# Altium schematic sheet 24.SchDoc
size 513 x 386 mm
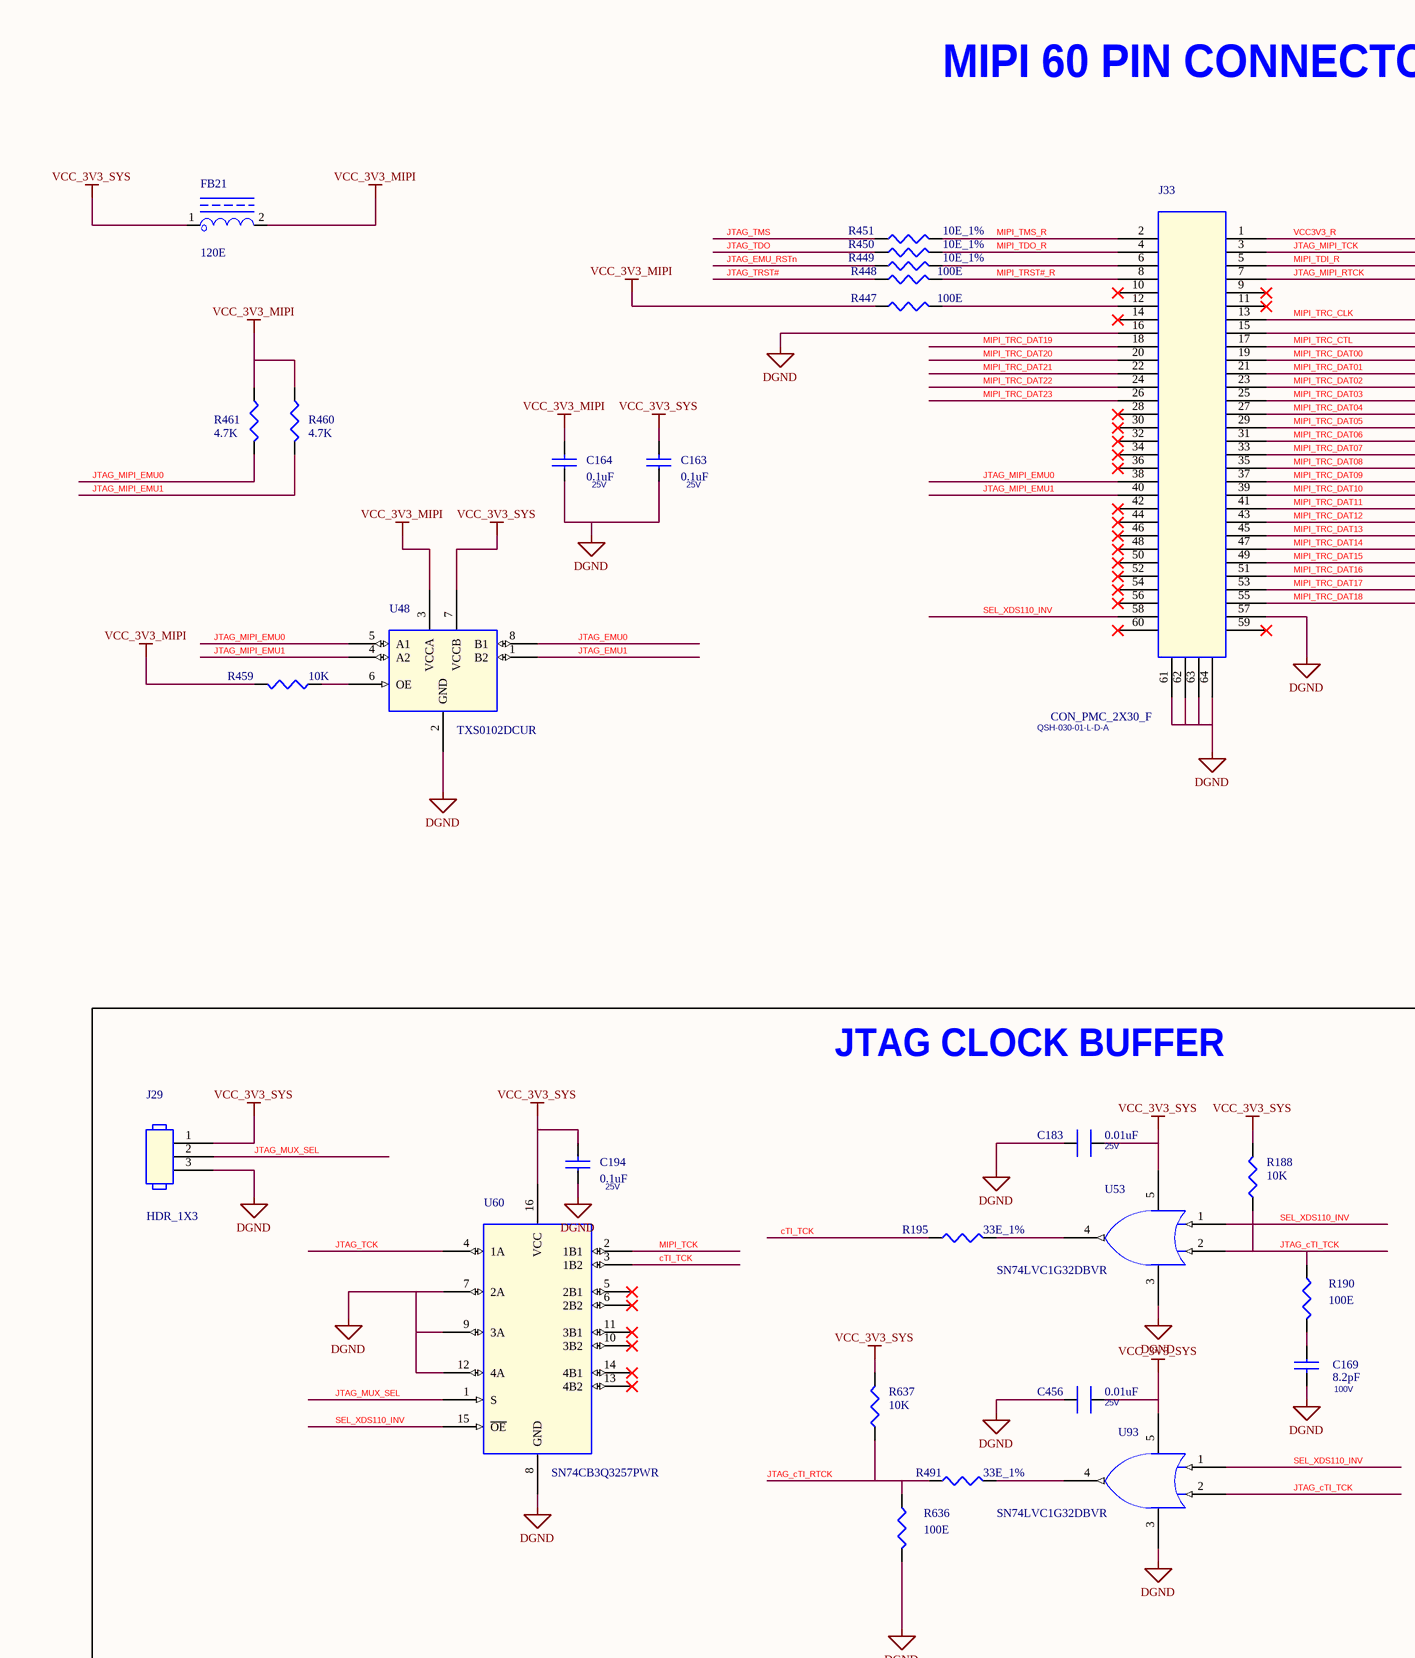
[diagram p0: 24.SchDoc, top left]
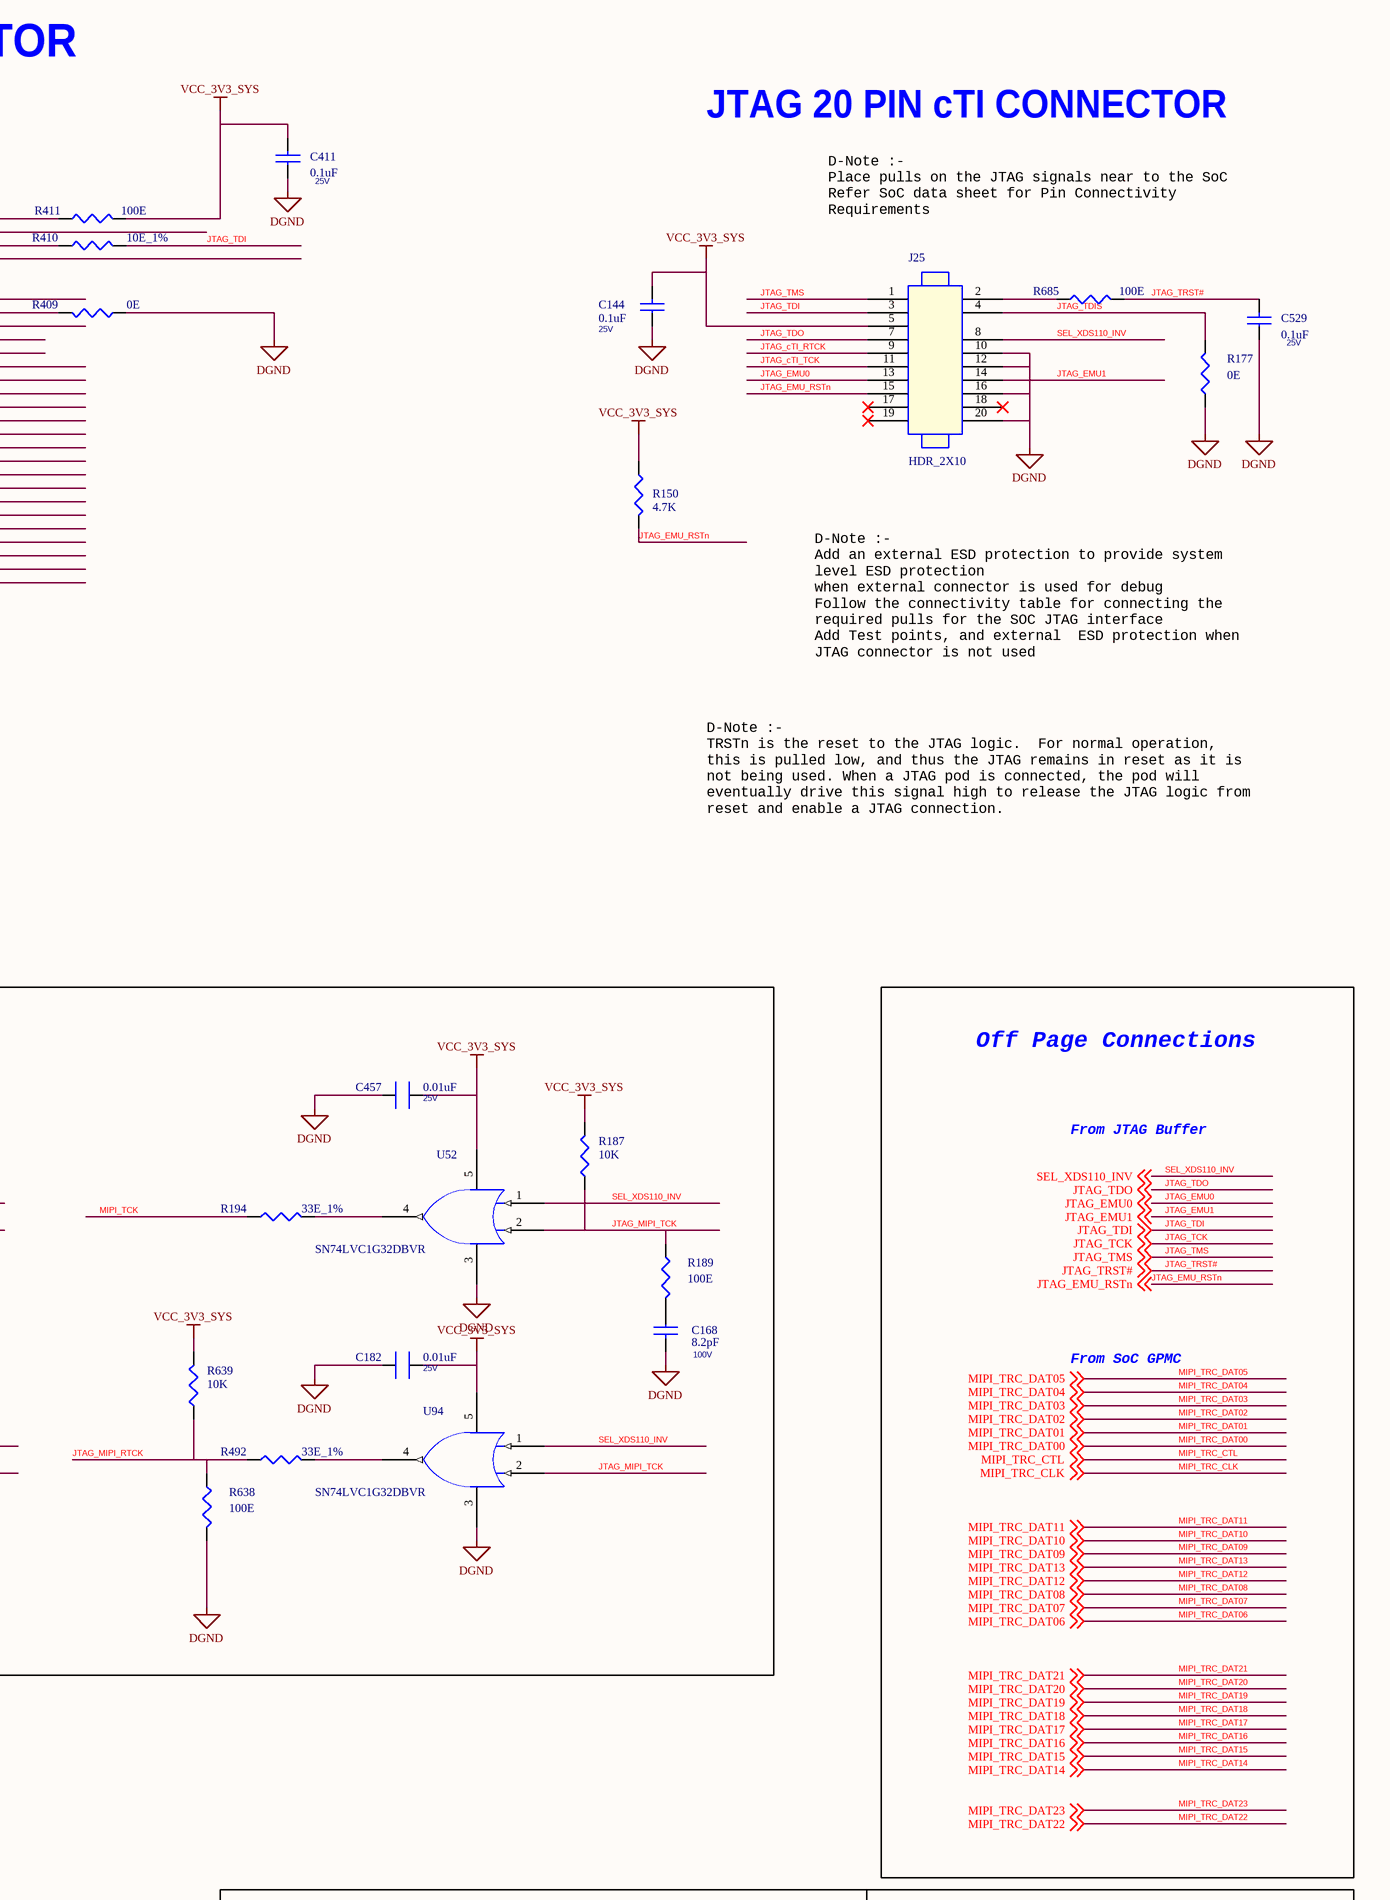
[diagram p1: 24.SchDoc, top right]
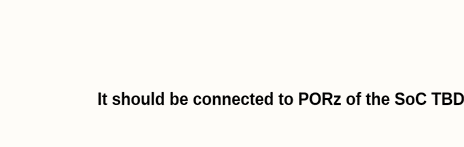
[diagram p2: 24.SchDoc, bottom left]
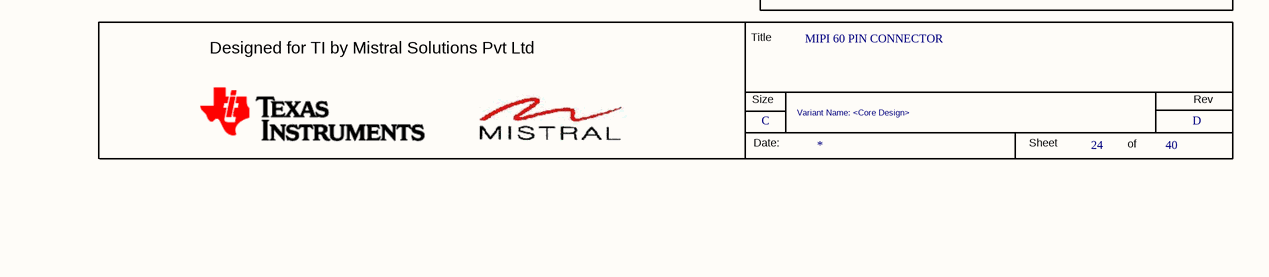
[diagram p3: 24.SchDoc, bottom right]

## Parts
*  RevCode: D  Title: MIPI 60 PIN CONNECTOR  Page Size: C  Page Number: 24  Page Count: 40  Variant Name: <Core Design>  (hidden comment: MISTRAL_TITLEBLK_CSIZE)  (graphical)
C144  0.1uF  Voltage: 25V  [CAP0402_0-75]
C163  0.1uF  Voltage: 25V  [CAP0402_0-75]
C164  0.1uF  Voltage: 25V  [CAP0402_0-75]
C168  8.2pF  Voltage: 100V  [CAP0402_0-75]
C169  8.2pF  Voltage: 100V  [CAP0402_0-75]
C182  0.01uF  Voltage: 25V  [CAP0402N]
C183  0.01uF  Voltage: 25V  [CAP0402N]
C194  0.1uF  Voltage: 25V  [CAP0402_0-75]
C411  0.1uF  Voltage: 25V  [CAP0402_0-75]
C456  0.01uF  Voltage: 25V  [CAP0402N]
C457  0.01uF  Voltage: 25V  [CAP0402N]
C529  0.1uF  Voltage: 25V  [CAP0402_0-75]
FB21  120E  [IND0603_1]
J25  HDR_2X10  [HDR_2X10_FTR-110-51-D-06_S_S_8-7]
J29  HDR_1X3  [HDR_3X1_100_S_T]
J33  CON_PMC_2X30_F  Mfr_part_number: QSH-030-01-L-D-A  [CON_PMC2X30_QSH-030-01-D-A_S_S_S_3-3]
R150  4.7K  [RES0402_0-5]
R177  0E  [RES0402_0-5]
R187  10K  [RES0402_0-5]
R188  10K  [RES0402_0-5]
R189  100E  [RES0402_0-5]
R190  100E  [RES0402_0-5]
R194  33E_1%  [RES0402_0-5]
R195  33E_1%  [RES0402_0-5]
R409  0E  [RES0402N]
R410  10E_1%  [RES0402N]
R411  100E  [RES0402N]
R447  100E  [RES0402N]
R448  100E  [RES0402N]
R449  10E_1%  [RES0402N]
R450  10E_1%  [RES0402N]
R451  10E_1%  [RES0402N]
R459  10K  [RES0402_0-5]
R460  4.7K  [RES0402_0-5]
R461  4.7K  [RES0402_0-5]
R491  33E_1%  [RES0402_0-5]
R492  33E_1%  [RES0402_0-5]
R636  100E  [RES0402_0-5]
R637  10K  [RES0402_0-5]
R638  100E  [RES0402_0-5]
R639  10K  [RES0402_0-5]
R685  100E  [RES0402N]
U48  TXS0102DCUR  [VSSOP8_19-68_85X95_0-9]
U52  SN74LVC1G32DBVR  [SOT23-5_1-5]
U53  SN74LVC1G32DBVR  [SOT23-5_1-5]
U60  SN74CB3Q3257PWR  [TSSOP16_25-59_205X180]
U93  SN74LVC1G32DBVR  [SOT23-5_1-5]
U94  SN74LVC1G32DBVR  [SOT23-5_1-5]

## Blocks framed on the sheet
JTAG CLOCK BUFFER: C168 C169 C182 C183 C194 C456 C457 J29 R187-R190 R194 R195 R491 R492 R636-R639 U52 U53 U60 U93 U94

## Nets
DGND: C144.1 C163.1 C164.1 C168.2 C169.2 C182.1 C183.1 C194.1 C411.1 C456.1 C457.1 C529.1 J25.10 J25.12 J25.16 J25.20 J29.3 J33.16 J33.57 J33.61 J33.62 J33.63 J33.64 R177.1 R409.1 R636.2 R638.2 U48.2(GND) U52.3(GND) U53.3(GND) U60.7(2A) U60.8(GND) U60.9(3A) U60.12(4A) U93.3(GND) U94.3(GND)
VCC_3V3_MIPI: C164.2 FB21.2 R447.1 R459.2 R460.1 R461.1 U48.3(VCCA)
VCC_3V3_SYS: C144.2 C163.2 C182.2 C183.2 C194.2 C411.2 C456.2 C457.2 FB21.1 J25.5 J29.1 R150.1 R187.2 R188.2 R411.2 R637.2 R639.2 U48.7(VCCB) U52.5(VCC) U53.5(VCC) U60.16(VCC) U93.5(VCC) U94.5(VCC)
cTI_TCK: R195.1 U60.3(1B2)
JTAG_cTI_RTCK: J25.9 R491.1 R636.1 R637.1
JTAG_cTI_TCK: J25.11 R188.1 R190.1 U53.2(B) U93.2(B)
JTAG_EMU0: J25.13 U48.8(B1) ; off-sheet JTAG_EMU0
JTAG_EMU1: J25.14 U48.1(B2) ; off-sheet JTAG_EMU1
JTAG_EMU_RSTn: J25.15 R150.2 R449.1 ; off-sheet JTAG_EMU_RSTn
JTAG_MIPI_EMU0: J33.38 R461.2 U48.5(A1)
JTAG_MIPI_EMU1: J33.40 R460.2 U48.4(A2)
JTAG_MIPI_RTCK: J33.7 R492.1 R638.1 R639.1
JTAG_MIPI_TCK: J33.3 R187.1 R189.1 U52.2(B) U94.2(B)
JTAG_MUX_SEL: J29.2 U60.1(S)
JTAG_TCK: U60.4(1A) ; off-sheet JTAG_TCK
JTAG_TDI: J25.3 R410.2 ; off-sheet JTAG_TDI
JTAG_TDIS: J25.4 R177.2
JTAG_TDO: J25.7 R450.1 ; off-sheet JTAG_TDO
JTAG_TMS: J25.1 R451.1 ; off-sheet JTAG_TMS
JTAG_TRST#: C529.2 R448.1 R685.2 ; off-sheet JTAG_TRST#
MIPI_TCK: R194.1 U60.2(1B1)
MIPI_TDI_R: J33.5 R410.1
MIPI_TDO_R: J33.4 R450.2
MIPI_TMS_R: J33.2 R451.2
MIPI_TRC_CLK: J33.13 ; off-sheet MIPI_TRC_CLK
MIPI_TRC_CTL: J33.17 ; off-sheet MIPI_TRC_CTL
MIPI_TRC_DAT00: J33.19 ; off-sheet MIPI_TRC_DAT00
MIPI_TRC_DAT01: J33.21 ; off-sheet MIPI_TRC_DAT01
MIPI_TRC_DAT02: J33.23 ; off-sheet MIPI_TRC_DAT02
MIPI_TRC_DAT03: J33.25 ; off-sheet MIPI_TRC_DAT03
MIPI_TRC_DAT04: J33.27 ; off-sheet MIPI_TRC_DAT04
MIPI_TRC_DAT05: J33.29 ; off-sheet MIPI_TRC_DAT05
MIPI_TRC_DAT06: J33.31 ; off-sheet MIPI_TRC_DAT06
MIPI_TRC_DAT07: J33.33 ; off-sheet MIPI_TRC_DAT07
MIPI_TRC_DAT08: J33.35 ; off-sheet MIPI_TRC_DAT08
MIPI_TRC_DAT09: J33.37 ; off-sheet MIPI_TRC_DAT09
MIPI_TRC_DAT10: J33.39 ; off-sheet MIPI_TRC_DAT10
MIPI_TRC_DAT11: J33.41 ; off-sheet MIPI_TRC_DAT11
MIPI_TRC_DAT12: J33.43 ; off-sheet MIPI_TRC_DAT12
MIPI_TRC_DAT13: J33.45 ; off-sheet MIPI_TRC_DAT13
MIPI_TRC_DAT14: J33.47 ; off-sheet MIPI_TRC_DAT14
MIPI_TRC_DAT15: J33.49 ; off-sheet MIPI_TRC_DAT15
MIPI_TRC_DAT16: J33.51 ; off-sheet MIPI_TRC_DAT16
MIPI_TRC_DAT17: J33.53 ; off-sheet MIPI_TRC_DAT17
MIPI_TRC_DAT18: J33.55 ; off-sheet MIPI_TRC_DAT18
MIPI_TRC_DAT19: J33.18 ; off-sheet MIPI_TRC_DAT19
MIPI_TRC_DAT20: J33.20 ; off-sheet MIPI_TRC_DAT20
MIPI_TRC_DAT21: J33.22 ; off-sheet MIPI_TRC_DAT21
MIPI_TRC_DAT22: J33.24 ; off-sheet MIPI_TRC_DAT22
MIPI_TRC_DAT23: J33.26 ; off-sheet MIPI_TRC_DAT23
MIPI_TRST#_R: J33.8 R448.2
SEL_XDS110_INV: J25.8 J33.58 U52.1(A) U53.1(A) U60.15(~{OE}) U93.1(A) U94.1(A) ; off-sheet SEL_XDS110_INV
VCC3V3_R: J33.1 R411.1
NetC168_1: C168.1 R189.2
NetC169_1: C169.1 R190.2
NetJ25_2: J25.2 R685.1
NetJ33_6: J33.6 R449.2
NetJ33_12: J33.12 R447.2
NetJ33_15: J33.15 R409.2
NetR194_2: R194.2 U52.4(Y)
NetR195_2: R195.2 U53.4(Y)
NetR459_1: R459.1 U48.6(OE)
NetR491_2: R491.2 U93.4(Y)
NetR492_2: R492.2 U94.4(Y)

Not connected (* = marked no-connect by the designer): J25 17* 18* 19*; J33 9* 10* 11* 14* 28* 30* 32* 34* 36* 42* 44* 46* 48* 50* 52* 54* 56* 59* 60*; U60 5(2B1)* 6(2B2)* 10(3B2)* 11(3B1)* 13(4B2)* 14(4B1)*

## Notes on the sheet
- MIPI 60 PIN CONNECTOR
- JTAG 20 PIN cTI CONNECTOR
- D-Note :-
  Place pulls on the JTAG signals near to the SoC
  Refer SoC data sheet for Pin Connectivity
  Requirements
- D-Note :-
  Add an external ESD protection to provide system
  level ESD protection
  when external connector is used for debug
  Follow the connectivity table for connecting the
  required pulls for the SOC JTAG interface
  Add Test points, and external  ESD protection when
  JTAG connector is not used
- D-Note :-
  TRSTn is the reset to the JTAG logic.  For normal operation,
  this is pulled low, and thus the JTAG remains in reset as it is
  not being used. When a JTAG pod is connected, the pod will
  eventually drive this signal high to release the JTAG logic from
  reset and enable a JTAG connection.
- Off Page Connections
- From JTAG Buffer
- From SoC GPMC
- It should be connected to PORz of the SoC TBD
- (in symbol MISTRAL_TITLEBLK_CSIZE) Title; Designed for TI by Mistral Solutions Pvt Ltd; Size; Rev; Date:; Sheet; of

## Library data of the parts
* = MISTRAL_TITLEBLK_CSIZE: Issue: 1.0; Page Create Date: March  8, 1995; Page Modify Date: *
C144 C163 C164 C194 C411 = CAP_Dup3: CAP CERAMIC 0.1uF 25V 20% X5R 0402; Alt_Mfr_name: YAGEO AMERICA; Part_type: CAPACITORS\CERAMIC; Mfr_part_number: 885012105018; Mfr_name: WURTH ELECTRONICS; Mistral Part No: 120020080003-R; Alt_Mfr_part_number: CC0402KRX5R8BB104; Custom_Duty: 15%; Customs_HS_Code: 85322990; Wattage: NA; Project: AM64x_EVM_BRD; Footprint Path: Y:\MIS_DATABASE\Library\ALTIUM_TOOL\PCB_FOOTPRINTS\Altium_Footprint_Lib.PcbLib; Library Path: Y:\MIS_DATABASE\Library\ALTIUM_TOOL\SCHEMATICS_PARTS\MS_DISCRETE_Library.schlib; Footprint Ref: CAP0402_0-75; Library Ref: CAP; MECHANICAL 3D STEP FILE: CAP0402_0-75; Chkd/date: MANIRAJA/170820; Crtd /date: ALVY/170820; Datasheet: Y:\MIS_DATABASE\DATASHEETS\CAPACITORS\885012105018.PDF; Temperature: -55癈+85癈; Weight: 0.65mg; Height: 0.55MM; Distributor_part_number: 732-7495-1-ND; Distributor_name: DIGIKEY; Package: 0402; Tolerance: 20%; PCB Footprint: CAP0402_0-75
C168 = CAP_Dup3: CAP CERAMIC 8.2pF 100V 0.5pF C0G(NP0) 0402; Part_type: CAPACITORS\CERAMIC; Mfr_part_number: 885012005085; Mfr_name: WURTH ELECTRONICS; Mistral Part No: 120020080006-R; Wattage: NA; Custom_Duty: 15%; Customs_HS_Code: 85322990; Tolerance: 0.5pF%; Project: AM64x_EVM_BRD; PCB Footprint: CAP0402_0-75; Footprint Path: Y:\MIS_DATABASE\Library\ALTIUM_TOOL\PCB_FOOTPRINTS\Altium_Footprint_Lib.PcbLib; Library Path: Y:\MIS_DATABASE\Library\ALTIUM_TOOL\SCHEMATICS_PARTS\MS_DISCRETE_Library.schlib; Footprint Ref: CAP0402_0-75; Library Ref: CAP; MECHANICAL 3D STEP FILE: CAP0402_0-75; Chkd/date: MANIRAJA/170820; Crtd /date: ALVY/170820; Datasheet: Y:\MIS_DATABASE\DATASHEETS\CAPACITORS\885012005085.PDF; Temperature: -55癈+125癈; Weight: 2.261mg; Height: 0.55MM; Distributor_part_number: 732-12053-1-ND; Distributor_name: DIGIKEY; Package: 0402
C169 = CAP_Dup3: CAP CERAMIC 8.2pF 100V 0.5pF C0G(NP0) 0402; Mistral Part No: 120020080006-R; Mfr_name: WURTH ELECTRONICS; Mfr_part_number: 885012005085; Part_type: CAPACITORS\CERAMIC; Project: AM64x_EVM_BRD; Tolerance: 0.5pF%; Customs_HS_Code: 85322990; Custom_Duty: 15%; Wattage: NA; PCB Footprint: CAP0402_0-75; Package: 0402; Distributor_name: DIGIKEY; Distributor_part_number: 732-12053-1-ND; Height: 0.55MM; Weight: 2.261mg; Temperature: -55癈+125癈; Datasheet: Y:\MIS_DATABASE\DATASHEETS\CAPACITORS\885012005085.PDF; Crtd /date: ALVY/170820; Chkd/date: MANIRAJA/170820; MECHANICAL 3D STEP FILE: CAP0402_0-75; Library Ref: CAP; Footprint Ref: CAP0402_0-75; Library Path: Y:\MIS_DATABASE\Library\ALTIUM_TOOL\SCHEMATICS_PARTS\MS_DISCRETE_Library.schlib; Footprint Path: Y:\MIS_DATABASE\Library\ALTIUM_TOOL\PCB_FOOTPRINTS\Altium_Footprint_Lib.PcbLib
C182 C183 C457 = CAP_Dup2: CAP CERAMIC 0.01uF 25V 10% X7R 0402; Part_type: CAPACITORS\CERAMIC; Mfr_part_number: 885012205050; Mfr_name: WURTH ELECTRONICS; Mistral Part No: 120011090040-R; PCB Footprint: CAP0402_0-75; Wattage: NA; Custom_Duty: 15%; Customs_HS_Code: 85322990; Project: AM64x_EVM_BRD; Footprint Path: Y:\MIS_DATABASE\Library\ALTIUM_TOOL\PCB_FOOTPRINTS\Altium_Footprint_Lib.PcbLib; Library Path: Y:\MIS_DATABASE\Library\ALTIUM_TOOL\SCHEMATICS_PARTS\MS_DISCRETE_Library.schlib; Footprint Ref: CAP0402_0-75; MECHANICAL 3D STEP FILE: CAP0402_0-75; Temperature: -55癈+125癈; Weight: 0.65mg; Chkd/date: MANIRAJA/170820; Crtd /date: ALVY/170820; Datasheet: Y:\MIS_DATABASE\DATASHEETS\CAPACITORS\885012205050.PDF; Height: 0.55MM; Distributor_part_number: 732-7545-1-ND; Distributor_name: DIGIKEY; Package: 0402; Tolerance: 10%; Library Ref: CAP
C456 = CAP_Dup2: CAP CERAMIC 0.01uF 25V 10% X7R 0402; Mistral Part No: 120011090040-R; Mfr_name: WURTH ELECTRONICS; Mfr_part_number: 885012205050; Part_type: CAPACITORS\CERAMIC; PCB Footprint: CAP0402_0-75; Project: AM64x_EVM_BRD; Customs_HS_Code: 85322990; Custom_Duty: 15%; Wattage: NA; Library Ref: CAP; Tolerance: 10%; Package: 0402; Distributor_name: DIGIKEY; Distributor_part_number: 732-7545-1-ND; Height: 0.55MM; Datasheet: Y:\MIS_DATABASE\DATASHEETS\CAPACITORS\885012205050.PDF; Crtd /date: ALVY/170820; Chkd/date: MANIRAJA/170820; Weight: 0.65mg; Temperature: -55癈+125癈; MECHANICAL 3D STEP FILE: CAP0402_0-75; Footprint Ref: CAP0402_0-75; Library Path: Y:\MIS_DATABASE\Library\ALTIUM_TOOL\SCHEMATICS_PARTS\MS_DISCRETE_Library.schlib; Footprint Path: Y:\MIS_DATABASE\Library\ALTIUM_TOOL\PCB_FOOTPRINTS\Altium_Footprint_Lib.PcbLib
C529 = CAP_Dup3: CAP CERAMIC 0.1uF 25V 20% X5R 0402; Alt_Mfr_part_number: CC0402KRX5R8BB104; Mistral Part No: 120020080003-R; Mfr_name: WURTH ELECTRONICS; Mfr_part_number: 885012105018; Part_type: CAPACITORS\CERAMIC; Alt_Mfr_name: YAGEO AMERICA; Project: AM64x_EVM_BRD; Wattage: NA; Customs_HS_Code: 85322990; Custom_Duty: 15%; Tolerance: 20%; Package: 0402; Distributor_name: DIGIKEY; Distributor_part_number: 732-7495-1-ND; Height: 0.55MM; Weight: 0.65mg; Temperature: -55癈+85癈; Datasheet: Y:\MIS_DATABASE\DATASHEETS\CAPACITORS\885012105018.PDF; Crtd /date: ALVY/170820; Chkd/date: MANIRAJA/170820; MECHANICAL 3D STEP FILE: CAP0402_0-75; Library Ref: CAP; Footprint Ref: CAP0402_0-75; Library Path: Y:\MIS_DATABASE\Library\ALTIUM_TOOL\SCHEMATICS_PARTS\MS_DISCRETE_Library.schlib; Footprint Path: Y:\MIS_DATABASE\Library\ALTIUM_TOOL\PCB_FOOTPRINTS\Altium_Footprint_Lib.PcbLib; PCB Footprint: CAP0402_0-75
FB21 = INDUCTOR_FERRITE: IND FERRITE BEAD CHIP 120E 2A 0603; Mfr_part_number: 782631141; Mfr_name: WURTH ELECTRONICS; Mistral Part No: 130020080015-R; Custom_Duty: 24%; Customs_HS_Code: 85437099; Wattage: NA; Tolerance: 25%; Project: AM64x_EVM_BRD; Footprint Path: Y:\MIS_DATABASE\Library\ALTIUM_TOOL\PCB_FOOTPRINTS\Altium_Footprint_Lib.PcbLib; Library Path: Y:\MIS_DATABASE\Library\ALTIUM_TOOL\SCHEMATICS_PARTS\MS_FILTER_Library.schlib; MECHANICAL 3D STEP FILE: IND0603_1; Chkd/date: MANIRAJA/180820; Crtd /date: ALVY/180820; Datasheet: Y:\MIS_DATABASE\DATASHEETS\DISCRETES\INDUCTORS\782631141.PDF; Temperature: -55癈+125癈; Weight: NA; Height: 1.00MM; Library Ref: INDUCTOR_FERRITE; Distributor_part_number: 732-782631141CT-ND; Distributor_name: DIGIKEY; Package: 0603; Voltage: NA; Part_type: INDUCTOR; Footprint Ref: IND0603_1; PCB Footprint: IND0603_1
J25 = HEADER_10X2_FTR-06: CON HDR 2X10 1.27MM PITCH ST SMD; Mistral Part No: 150011090001-R; Mfr_name: SAMTEC; Mfr_part_number: FTR-110-51-S-D-06; Part_type: CONNECTOR\HEADERS; Project: GEMYC; Tolerance: NA; Customs_HS_Code: 85369090; Custom_Duty: 24%; Footprint Ref: HDR_2X10_FTR-110-51-D-06_S_S_8-7; Voltage: NA; Wattage: NA; Package: SMD; Distributor_name: DIGIKEY; Distributor_part_number: SAM8792-ND; Library Ref: HEADER_10X2_FTR-06; Height: 8.67MM; Weight: NA; Temperature: -55癈+125癈; Datasheet: Y:\MIS_DATABASE\DATASHEETS\CONNECTORS\FTR-D-SER.PDF; Crtd /date: CHAITHANYA/050811; Chkd/date: MANIRAJA/031218; MECHANICAL 3D STEP FILE: HDR_2X10_FTR-110-51-D-06_S_S_8-7; Library Path: Y:\MIS_DATABASE\Library\ALTIUM_TOOL\SCHEMATICS_PARTS\MS_CONNECTOR_Library.schlib; Footprint Path: Y:\MIS_DATABASE\Library\ALTIUM_TOOL\PCB_FOOTPRINTS\Altium_Footprint_Lib.PcbLib; PCB Footprint: HDR_2X10_FTR-110-51-D-06_S_S_8-7
J29 = HEADER_3X1: HDR 1X3 2.54MM PITCH ST TH; Part_type: CONNECTOR\HEADERS; Mfr_part_number: 68001-403HLF; Mfr_name: FCI; Mistral Part No: 150016060025-R; Custom_Duty: 15%; Customs_HS_Code: 85322990; Wattage: NA; Project: IKEYP; Library Ref: HEADER_3X1; Chkd/date: VASANTHA/290616; Crtd /date: VASANTHA/290616; Datasheet: Y:\MIS_DATABASE\DATASHEETS\CONNECTORS\68000.PDF; Temperature: -40癈+105癈; Weight: NA; Height: 8.58MM; Distributor_part_number: 609-3471-ND; Distributor_name: DIGIKEY; Package: THRU-HOLE; Voltage: NA; Tolerance: NA; PCB Footprint: HDR_3X1_100_S_T
J33 = CON_PMC_30X2_F: CON PMC 2X30 0.50MM PITCH FEMALE ST SMD; Part_type: CONNECTOR\PMC; Mfr_name: SAMTEC; Mistral Part No: 150009030606-R; Wattage: NA; Custom_Duty: 24%; Customs_HS_Code: 85369090; Project: KHAN_HSST; PCB Footprint: CON_PMC2X30_QSH-030-01-D-A_S_S_S_3-3; Footprint Path: Y:\MIS_DATABASE\Library\ALTIUM_TOOL\PCB_FOOTPRINTS\Altium_Footprint_Lib.PcbLib; Library Path: Y:\MIS_DATABASE\Library\ALTIUM_TOOL\SCHEMATICS_PARTS\MS_CONNECTOR_Library.schlib; MECHANICAL 3D STEP FILE: CON_PMC2X30_QSH-030-01-D-A_S_S_S_3-3; Temperature: -55癈+125癈; Weight: NA; Distributor_part_number: SAM8180-ND; Distributor_name: DIGIKEY; Voltage: NA; Tolerance: NA; Footprint Ref: CON_PMC2X30_QSH-030-01-D-A_S_S_S_3-3; Chkd/date: MANIRAJA/011018; Crtd /date: USMAN/051108; Datasheet: Y:\MIS_DATABASE\DATASHEETS\CONNECTORS\QSH.PDF; Height: 3.25MM; Package: SMD; Library Ref: CON_PMC_30X2_F_4SH
R150 R460 = RESISTOR_Dup4: RES 4.7K 1/16W 5% 0402; Mistral Part No: 110011060001-R; Mfr_name: YAGEO AMERICA; Mfr_part_number: RC0402JR-074K7L; Part_type: RESISTORS\FIXED; Project: TMDXCSK368; Voltage: NA; Customs_HS_Code: 85332119; Custom_Duty: 15%; Footprint Path: Y:\MIS_DATABASE\Library\ALTIUM_TOOL\PCB_FOOTPRINTS\Altium_Footprint_Lib.PcbLib; Library Path: Y:\MIS_DATABASE\Library\ALTIUM_TOOL\SCHEMATICS_PARTS\MS_DISCRETE_Library.schlib; MECHANICAL 3D STEP FILE: RES0402_0-5; Footprint Ref: RES0402_0-5; Library Ref: RESISTOR; Tolerance: 5%; Wattage: 1/16W; Package: 0402; Distributor_name: DIGIKEY; Distributor_part_number: 311-4.7KJRCT-ND; Height: 0.40MM; Weight: 0.65mg; Temperature: -55癈+155癈; Datasheet: Y:\MIS_DATABASE\DATASHEETS\RESISTORS\RCXXXXL-SER_MAR18.PDF; Crtd /date: VASANTHA/130516; Chkd/date: VASANTHA/130516; PCB Footprint: RES0402_0-5
R177 = RESISTOR_Dup5: RES 0E 1/16W JUMPER 0402; Part_type: RESISTORS\FIXED; Mfr_part_number: CRCW04020000Z0ED; Mfr_name: VISHAY; Mistral Part No: 110010080019-R; Custom_Duty: 15%; Customs_HS_Code: 85332119; Voltage: NA; Project: PB_BUGBASE; Footprint Path: Y:\MIS_DATABASE\Library\ALTIUM_TOOL\PCB_FOOTPRINTS\Altium_Footprint_Lib.PcbLib; Library Path: Y:\MIS_DATABASE\Library\ALTIUM_TOOL\SCHEMATICS_PARTS\MS_DISCRETE_Library.schlib; Footprint Ref: RES0402_0-5; Library Ref: RESISTOR; MECHANICAL 3D STEP FILE: RES0402_0-5; Chkd/date: VASANTHA/201216; Crtd /date: MUDDU/190810; Datasheet: Y:\MIS_DATABASE\DATASHEETS\RESISTORS\CRCW0603.PDF; Temperature: -55癈+155癈; Weight: 0.65mg; Height: 0.40MM; Distributor_part_number: 541-0.0JCT-ND; Distributor_name: DIGIKEY; Package: 0402; Wattage: 1/16W; Tolerance: NA; PCB Footprint: RES0402_0-5
R187 R639 = RESISTOR_Dup6: RES 10K 1/16W 5% 0402; Mistral Part No: 110011060021-R; Mfr_name: YAGEO AMERICA; Mfr_part_number: RC0402JR-0710KL; Part_type: RESISTORS\FIXED; Project: HSE; Voltage: NA; Customs_HS_Code: 85332119; Custom_Duty: 15%; Footprint Path: Y:\MIS_DATABASE\Library\ALTIUM_TOOL\PCB_FOOTPRINTS\Altium_Footprint_Lib.PcbLib; Library Path: Y:\MIS_DATABASE\Library\ALTIUM_TOOL\SCHEMATICS_PARTS\MS_DISCRETE_Library.schlib; Footprint Ref: RES0402_0-5; Library Ref: RESISTOR; Tolerance: 5%; Wattage: 1/16W; Package: 0402; Distributor_name: DIGIKEY; Distributor_part_number: 311-10KJRCT-ND; Height: 0.40MM; Weight: 0.65mg; Temperature: -55癈+155癈; Datasheet: Y:\MIS_DATABASE\DATASHEETS\RESISTORS\RCXXXXL-SER_MAR18.PDF; Crtd /date: MAZHAR/230805; Chkd/date: VASANTHA/061216; MECHANICAL 3D STEP FILE: RES0402_0-5; PCB Footprint: RES0402_0-5
R188 R459 R637 = RESISTOR_Dup6: RES 10K 1/16W 5% 0402; Part_type: RESISTORS\FIXED; Mfr_part_number: RC0402JR-0710KL; Mfr_name: YAGEO AMERICA; Mistral Part No: 110011060021-R; Custom_Duty: 15%; Customs_HS_Code: 85332119; Voltage: NA; Project: HSE; MECHANICAL 3D STEP FILE: RES0402_0-5; Chkd/date: VASANTHA/061216; Crtd /date: MAZHAR/230805; Datasheet: Y:\MIS_DATABASE\DATASHEETS\RESISTORS\RCXXXXL-SER_MAR18.PDF; Temperature: -55癈+155癈; Weight: 0.65mg; Height: 0.40MM; Distributor_part_number: 311-10KJRCT-ND; Distributor_name: DIGIKEY; Package: 0402; Wattage: 1/16W; Tolerance: 5%; Library Ref: RESISTOR; Footprint Ref: RES0402_0-5; Library Path: Y:\MIS_DATABASE\Library\ALTIUM_TOOL\SCHEMATICS_PARTS\MS_DISCRETE_Library.schlib; Footprint Path: Y:\MIS_DATABASE\Library\ALTIUM_TOOL\PCB_FOOTPRINTS\Altium_Footprint_Lib.PcbLib; PCB Footprint: RES0402_0-5
R189 R190 R638 = RESISTOR_Dup6: RES 100E 1/16W 5% 0402; Part_type: RESISTORS\FIXED; Mfr_part_number: CRCW0402100RJNED; Mfr_name: VISHAY; Mistral Part No: 110014060039-R; Custom_Duty: 15%; Customs_HS_Code: 85332119; Voltage: NA; Project: TI_MAXIE_CPB; PCB Footprint: RES0402_0-5; MECHANICAL 3D STEP FILE: RES0402_0-5; Chkd/date: MANIRAJA/230817; Crtd /date: MANIRAJA/230817; Datasheet: Y:\MIS_DATABASE\DATASHEETS\RESISTORS\CRCW0603.PDF; Temperature: -55癈+155癈; Weight: 0.65mg; Height: 0.40MM; Distributor_part_number: 541-100JCT-ND; Distributor_name: DIGIKEY; Package: 0402; Wattage: 1/16W; Tolerance: 5%; Library Ref: RESISTOR; Footprint Ref: RES0402_0-5; Library Path: Y:\MIS_DATABASE\Library\ALTIUM_TOOL\SCHEMATICS_PARTS\MS_DISCRETE_Library.schlib; Footprint Path: Y:\MIS_DATABASE\Library\ALTIUM_TOOL\PCB_FOOTPRINTS\Altium_Footprint_Lib.PcbLib
R194 R492 = RESISTOR_Dup6: RES 33E 1/10W 1% 0402; Part_type: RESISTORS\FIXED; Mfr_part_number: ERJ-2RKF33R0X; Mfr_name: PANASONIC-ECG; Mistral Part No: 110014110006-R; Custom_Duty: 15%; Customs_HS_Code: 85332119; Voltage: NA; Project: ZK BIOMETRIC; PCB Footprint: RES0402_0-5; MECHANICAL 3D STEP FILE: RES0402_0-5; Chkd/date: VASANTHA/061216; Crtd /date: JEBRAN/171114; Datasheet: Y:\MIS_DATABASE\DATASHEETS\RESISTORS\PAN-ERJSER_NOV17.PDF; Temperature: -55癈+155癈; Weight: 0.8mg; Height: 0.40MM; Distributor_part_number: P33.0LCT-ND; Distributor_name: DIGIKEY; Package: 0402; Wattage: 1/10W; Tolerance: 1%; Library Ref: RESISTOR; Footprint Ref: RES0402_0-5; Library Path: Y:\MIS_DATABASE\Library\ALTIUM_TOOL\SCHEMATICS_PARTS\MS_DISCRETE_Library.schlib; Footprint Path: Y:\MIS_DATABASE\Library\ALTIUM_TOOL\PCB_FOOTPRINTS\Altium_Footprint_Lib.PcbLib
R195 R491 = RESISTOR_Dup6: RES 33E 1/10W 1% 0402; Mistral Part No: 110014110006-R; Mfr_name: PANASONIC-ECG; Mfr_part_number: ERJ-2RKF33R0X; Part_type: RESISTORS\FIXED; Project: ZK BIOMETRIC; Voltage: NA; Customs_HS_Code: 85332119; Custom_Duty: 15%; Footprint Path: Y:\MIS_DATABASE\Library\ALTIUM_TOOL\PCB_FOOTPRINTS\Altium_Footprint_Lib.PcbLib; Library Path: Y:\MIS_DATABASE\Library\ALTIUM_TOOL\SCHEMATICS_PARTS\MS_DISCRETE_Library.schlib; Footprint Ref: RES0402_0-5; Library Ref: RESISTOR; Tolerance: 1%; Wattage: 1/10W; Package: 0402; Distributor_name: DIGIKEY; Distributor_part_number: P33.0LCT-ND; Height: 0.40MM; Weight: 0.8mg; Temperature: -55癈+155癈; Datasheet: Y:\MIS_DATABASE\DATASHEETS\RESISTORS\PAN-ERJSER_NOV17.PDF; Crtd /date: JEBRAN/171114; Chkd/date: VASANTHA/061216; MECHANICAL 3D STEP FILE: RES0402_0-5; PCB Footprint: RES0402_0-5
R409 = RESISTOR_Dup3: RES 0E 1/16W JUMPER 0402; Mistral Part No: 110010080019-R; Mfr_name: VISHAY; Mfr_part_number: CRCW04020000Z0ED; Part_type: RESISTORS\FIXED; MECHANICAL 3D STEP FILE: RES0402_0-5; Voltage: NA; Project: PB_BUGBASE; Customs_HS_Code: 85332119; Custom_Duty: 15%; Footprint Path: Y:\MIS_DATABASE\Library\ALTIUM_TOOL\PCB_FOOTPRINTS\Altium_Footprint_Lib.PcbLib; Library Path: Y:\MIS_DATABASE\Library\ALTIUM_TOOL\SCHEMATICS_PARTS\MS_DISCRETE_Library.schlib; Footprint Ref: RES0402_0-5; Library Ref: RESISTOR; Temperature: -55癈+155癈; Weight: 0.65mg; Tolerance: NA; Wattage: 1/16W; Package: 0402; Distributor_name: DIGIKEY; Distributor_part_number: 541-0.0JCT-ND; Height: 0.40MM; Datasheet: Y:\MIS_DATABASE\DATASHEETS\RESISTORS\CRCW0603.PDF; Crtd /date: MUDDU/190810; Chkd/date: VASANTHA/201216; PCB Footprint: RES0402_0-5
R410 = RESISTOR_Dup3: RES 10E 1/16W 1% 0402; Mistral Part No: 110018020004-R; Mfr_name: YAGEO AMERICA; Mfr_part_number: RC0402FR-0710RL; Part_type: RESISTORS\FIXED; MECHANICAL 3D STEP FILE: RES0402_0-5; Voltage: NA; Project: TI_MAXIE_CPB; Customs_HS_Code: 85332119; Custom_Duty: 15%; Library Ref: RESISTOR; Temperature: -55癈+155癈; Weight: 0.65mg; Tolerance: 1%; Wattage: 1/16W; Package: 0402; Distributor_name: DIGIKEY; Distributor_part_number: 311-10.0LRCT-ND; Height: 0.40MM; Datasheet: Y:\MIS_DATABASE\DATASHEETS\RESISTORS\RCXXXXL-SER_MAR18.PDF; Crtd /date: ALVY/070218; Chkd/date: MANIRAJA/070218; PCB Footprint: RES0402_0-5; Footprint Ref: RES0402_0-5; Library Path: Y:\MIS_DATABASE\Library\ALTIUM_TOOL\SCHEMATICS_PARTS\MS_DISCRETE_Library.schlib; Footprint Path: Y:\MIS_DATABASE\Library\ALTIUM_TOOL\PCB_FOOTPRINTS\Altium_Footprint_Lib.PcbLib
R411 R685 = RESISTOR_Dup2: RES 100E 1/16W 5% 0402; Part_type: RESISTORS\FIXED; Mfr_part_number: CRCW0402100RJNED; Mfr_name: VISHAY; Mistral Part No: 110014060039-R; MECHANICAL 3D STEP FILE: RES0402_0-5; Custom_Duty: 15%; Customs_HS_Code: 85332119; Voltage: NA; Project: TI_MAXIE_CPB; Library Ref: RESISTOR; Chkd/date: MANIRAJA/230817; Crtd /date: MANIRAJA/230817; Datasheet: Y:\MIS_DATABASE\DATASHEETS\RESISTORS\CRCW0603.PDF; Temperature: -55癈+155癈; Weight: 0.65mg; Height: 0.40MM; Distributor_part_number: 541-100JCT-ND; Distributor_name: DIGIKEY; Package: 0402; Wattage: 1/16W; Tolerance: 5%; PCB Footprint: RES0402_0-5; Footprint Ref: RES0402_0-5; Library Path: Y:\MIS_DATABASE\Library\ALTIUM_TOOL\SCHEMATICS_PARTS\MS_DISCRETE_Library.schlib; Footprint Path: Y:\MIS_DATABASE\Library\ALTIUM_TOOL\PCB_FOOTPRINTS\Altium_Footprint_Lib.PcbLib
R447 = RESISTOR_Dup2: RES 100E 1/16W 5% 0402; Mistral Part No: 110014060039-R; Mfr_name: VISHAY; Mfr_part_number: CRCW0402100RJNED; Part_type: RESISTORS\FIXED; Project: TI_MAXIE_CPB; Voltage: NA; Customs_HS_Code: 85332119; Custom_Duty: 15%; MECHANICAL 3D STEP FILE: RES0402_0-5; Tolerance: 5%; Wattage: 1/16W; Package: 0402; Distributor_name: DIGIKEY; Distributor_part_number: 541-100JCT-ND; Height: 0.40MM; Weight: 0.65mg; Temperature: -55癈+155癈; Datasheet: Y:\MIS_DATABASE\DATASHEETS\RESISTORS\CRCW0603.PDF; Crtd /date: MANIRAJA/230817; Chkd/date: MANIRAJA/230817; Library Ref: RESISTOR; PCB Footprint: RES0402_0-5; Footprint Ref: RES0402_0-5; Library Path: Y:\MIS_DATABASE\Library\ALTIUM_TOOL\SCHEMATICS_PARTS\MS_DISCRETE_Library.schlib; Footprint Path: Y:\MIS_DATABASE\Library\ALTIUM_TOOL\PCB_FOOTPRINTS\Altium_Footprint_Lib.PcbLib
R448 = RESISTOR_Dup2: RES 100E 1/16W 5% 0402; Part_type: RESISTORS\FIXED; Mfr_part_number: CRCW0402100RJNED; Mfr_name: VISHAY; Mistral Part No: 110014060039-R; PCB Footprint: RES0402_0-5; Custom_Duty: 15%; Customs_HS_Code: 85332119; Voltage: NA; Project: TI_MAXIE_CPB; Footprint Path: Y:\MIS_DATABASE\Library\ALTIUM_TOOL\PCB_FOOTPRINTS\Altium_Footprint_Lib.PcbLib; Library Path: Y:\MIS_DATABASE\Library\ALTIUM_TOOL\SCHEMATICS_PARTS\MS_DISCRETE_Library.schlib; Footprint Ref: RES0402_0-5; Library Ref: RESISTOR; MECHANICAL 3D STEP FILE: RES0402_0-5; Chkd/date: MANIRAJA/230817; Crtd /date: MANIRAJA/230817; Datasheet: Y:\MIS_DATABASE\DATASHEETS\RESISTORS\CRCW0603.PDF; Temperature: -55癈+155癈; Weight: 0.65mg; Height: 0.40MM; Distributor_part_number: 541-100JCT-ND; Distributor_name: DIGIKEY; Package: 0402; Wattage: 1/16W; Tolerance: 5%
R449 R451 = RESISTOR_Dup3: RES 10E 1/16W 1% 0402; Part_type: RESISTORS\FIXED; Mfr_part_number: RC0402FR-0710RL; Mfr_name: YAGEO AMERICA; Mistral Part No: 110018020004-R; Custom_Duty: 15%; Customs_HS_Code: 85332119; Project: TI_MAXIE_CPB; Voltage: NA; MECHANICAL 3D STEP FILE: RES0402_0-5; Chkd/date: MANIRAJA/070218; Crtd /date: ALVY/070218; Datasheet: Y:\MIS_DATABASE\DATASHEETS\RESISTORS\RCXXXXL-SER_MAR18.PDF; Height: 0.40MM; Distributor_part_number: 311-10.0LRCT-ND; Distributor_name: DIGIKEY; Package: 0402; Wattage: 1/16W; Tolerance: 1%; Weight: 0.65mg; Temperature: -55癈+155癈; Library Ref: RESISTOR; PCB Footprint: RES0402_0-5; Footprint Ref: RES0402_0-5; Library Path: Y:\MIS_DATABASE\Library\ALTIUM_TOOL\SCHEMATICS_PARTS\MS_DISCRETE_Library.schlib; Footprint Path: Y:\MIS_DATABASE\Library\ALTIUM_TOOL\PCB_FOOTPRINTS\Altium_Footprint_Lib.PcbLib
R450 = RESISTOR_Dup3: RES 10E 1/16W 1% 0402; Mistral Part No: 110018020004-R; Mfr_name: YAGEO AMERICA; Mfr_part_number: RC0402FR-0710RL; Part_type: RESISTORS\FIXED; Project: TI_MAXIE_CPB; Customs_HS_Code: 85332119; Custom_Duty: 15%; Voltage: NA; MECHANICAL 3D STEP FILE: RES0402_0-5; Tolerance: 1%; Wattage: 1/16W; Package: 0402; Distributor_name: DIGIKEY; Distributor_part_number: 311-10.0LRCT-ND; Height: 0.40MM; Datasheet: Y:\MIS_DATABASE\DATASHEETS\RESISTORS\RCXXXXL-SER_MAR18.PDF; Crtd /date: ALVY/070218; Chkd/date: MANIRAJA/070218; Weight: 0.65mg; Temperature: -55癈+155癈; Library Ref: RESISTOR; PCB Footprint: RES0402_0-5; Footprint Ref: RES0402_0-5; Library Path: Y:\MIS_DATABASE\Library\ALTIUM_TOOL\SCHEMATICS_PARTS\MS_DISCRETE_Library.schlib; Footprint Path: Y:\MIS_DATABASE\Library\ALTIUM_TOOL\PCB_FOOTPRINTS\Altium_Footprint_Lib.PcbLib
R461 = RESISTOR_Dup4: RES 4.7K 1/16W 5% 0402; Part_type: RESISTORS\FIXED; Mfr_part_number: RC0402JR-074K7L; Mfr_name: YAGEO AMERICA; Mistral Part No: 110011060001-R; Custom_Duty: 15%; Customs_HS_Code: 85332119; Voltage: NA; Project: TMDXCSK368; Footprint Path: Y:\MIS_DATABASE\Library\ALTIUM_TOOL\PCB_FOOTPRINTS\Altium_Footprint_Lib.PcbLib; Library Path: Y:\MIS_DATABASE\Library\ALTIUM_TOOL\SCHEMATICS_PARTS\MS_DISCRETE_Library.schlib; MECHANICAL 3D STEP FILE: RES0402_0-5; Footprint Ref: RES0402_0-5; Chkd/date: VASANTHA/130516; Crtd /date: VASANTHA/130516; Datasheet: Y:\MIS_DATABASE\DATASHEETS\RESISTORS\RCXXXXL-SER_MAR18.PDF; Temperature: -55癈+155癈; Weight: 0.65mg; Height: 0.40MM; Distributor_part_number: 311-4.7KJRCT-ND; Distributor_name: DIGIKEY; Package: 0402; Wattage: 1/16W; Tolerance: 5%; Library Ref: RESISTOR; PCB Footprint: RES0402_0-5
R636 = RESISTOR_Dup6: RES 100E 1/16W 5% 0402; Mistral Part No: 110014060039-R; Mfr_name: VISHAY; Mfr_part_number: CRCW0402100RJNED; Part_type: RESISTORS\FIXED; Project: TI_MAXIE_CPB; Voltage: NA; Customs_HS_Code: 85332119; Custom_Duty: 15%; Tolerance: 5%; Wattage: 1/16W; Package: 0402; Distributor_name: DIGIKEY; Distributor_part_number: 541-100JCT-ND; Height: 0.40MM; Weight: 0.65mg; Temperature: -55癈+155癈; Datasheet: Y:\MIS_DATABASE\DATASHEETS\RESISTORS\CRCW0603.PDF; Crtd /date: MANIRAJA/230817; Chkd/date: MANIRAJA/230817; MECHANICAL 3D STEP FILE: RES0402_0-5; Library Ref: RESISTOR; Footprint Ref: RES0402_0-5; Library Path: Y:\MIS_DATABASE\Library\ALTIUM_TOOL\SCHEMATICS_PARTS\MS_DISCRETE_Library.schlib; Footprint Path: Y:\MIS_DATABASE\Library\ALTIUM_TOOL\PCB_FOOTPRINTS\Altium_Footprint_Lib.PcbLib; PCB Footprint: RES0402_0-5
U48 = TXS0102DCUR_VSSOP8: IC 2BIT BI-DIR VOLTAGE-LEVEL TRANSLATOR US8(VSSOP8); Part_type: ICS\INTERFACE\LEVEL TRANSLATOR; Mfr_name: TEXAS INSTRUMENTS; Mistral Part No: 141009030376-R; Custom_Duty: 15%; Customs_HS_Code: 85423100; Wattage: NA; Project: SD_WATERLOO; Footprint Path: Y:\MIS_DATABASE\Library\ALTIUM_TOOL\PCB_FOOTPRINTS\Altium_Footprint_Lib.PcbLib; Library Path: Y:\MIS_DATABASE\Library\ALTIUM_TOOL\SCHEMATICS_PARTS\MS_MISCINTERFACE_Library.schlib; MECHANICAL 3D STEP FILE: VSSOP8_19-68_85X95_0-9; Chkd/date: MANIRAJA/130617; Crtd /date: SHREESHAIL/190108; Datasheet: Y:\MIS_DATABASE\DATASHEETS\ICS\INTERFACE\TXS0102.PDF; Temperature: -40癈+85癈; Weight: 9.6mg; Height: 0.90MM; Distributor_part_number: 296-21931-1-ND; Distributor_name: DIGIKEY; Package: US8; Voltage: NA; Tolerance: NA; Mfr_part_number: TXS0102DCUR; Library Ref: TXS0102DCUR_VSSOP8; Footprint Ref: VSSOP8_19-68_85X95_0-9; PCB Footprint: VSSOP8_19-68_85X95_0-9
U52 U53 U93 U94 = SN74LVC1G32DBVR_SOT23-5: IC SINGAL 2 INPUT POSITIVE OR GATE SOT23-5; Part_type: ICS\DIGITAL\GATES; Mfr_name: TEXAS INSTRUMENTS; Mistral Part No: 141009030236-R; Custom_Duty: 15%; Customs_HS_Code: 85423100; Wattage: NA; Project: SVDO_RMB_MMA; PCB Footprint: SOT23-5_1-5; MECHANICAL 3D STEP FILE: SOT23-5_1-5; Chkd/date: MANIRAJA/051017; Crtd /date: MAZHAR/070806; Datasheet: Y:\MIS_DATABASE\DATASHEETS\ICS\DIGITAL\GATES\SN74LVC1G32.PDF; Temperature: -40癈+85癈; Weight: 6.3mg; Height: 1.45MM; Distributor_part_number: 296-9847-1-ND; Distributor_name: DIGIKEY; Package: SOT23-5; Voltage: NA; Tolerance: NA; Mfr_part_number: SN74LVC1G32DBVR; Library Ref: SN74LVC1G32DBVR_SOT23-5
U60 = SN74CB3Q3257PWR_TSSOP16: IC 4BIT 1-OF-2 FET MULTIPLEXER/DEMULTIPLEXER TSSOP16; Mistral Part No: 141009030117-R; Mfr_name: TEXAS INSTRUMENTS; Part_type: ICS\DIGITAL\COMBINATIONAL; Project: OMAP_EVM; Customs_HS_Code: 85423100; Custom_Duty: 15%; Library Ref: SN74CB3Q3257PWR_TSSOP16; Mfr_part_number: SN74CB3Q3257PWR; Package: TSSOP16; Distributor_name: DIGIKEY; Distributor_part_number: 296-19138-1-ND; Height: 1.20MM; Temperature: -40癈+85癈; Datasheet: Y:\MIS_DATABASE\DATASHEETS\ICS\DIGITAL\COMBINATIONAL\SN74CB3Q3257.PDF; Crtd /date: USMAN/060109; Chkd/date: SUHAS/251010; RoHS: Sb/ Br FREE; PCB Footprint: TSSOP16_25-59_205X180